# Altium project CPUboard.PrjPCB
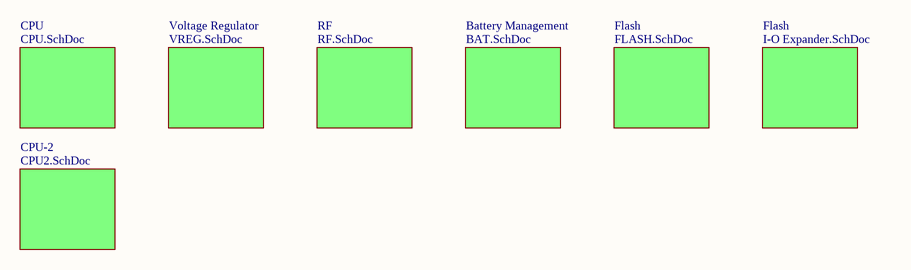
[diagram p0: CPUboard.SchDoc]
8 sheets, 86 parts. Net scope: flat (ports and power ports of the same name join across sheets).
Board file: CPUBoard.PcbDoc
Sheets:
  CPUboard.SchDoc
    RF = RF.SchDoc
    CPU = CPU.SchDoc
    Voltage Regulator = VREG.SchDoc
    Battery Management = BAT.SchDoc
    Flash = FLASH.SchDoc
    CPU-2 = CPU2.SchDoc
    Flash = I-O Expander.SchDoc

## Sheet CPUboard.SchDoc
size A

### Sub-sheets
Battery Management = BAT.SchDoc: no entries
CPU = CPU.SchDoc: no entries
CPU-2 = CPU2.SchDoc: no entries
Flash = FLASH.SchDoc: no entries
Flash = I-O Expander.SchDoc: no entries
RF = RF.SchDoc: no entries
Voltage Regulator = VREG.SchDoc: no entries

## Sheet RF.SchDoc
size A
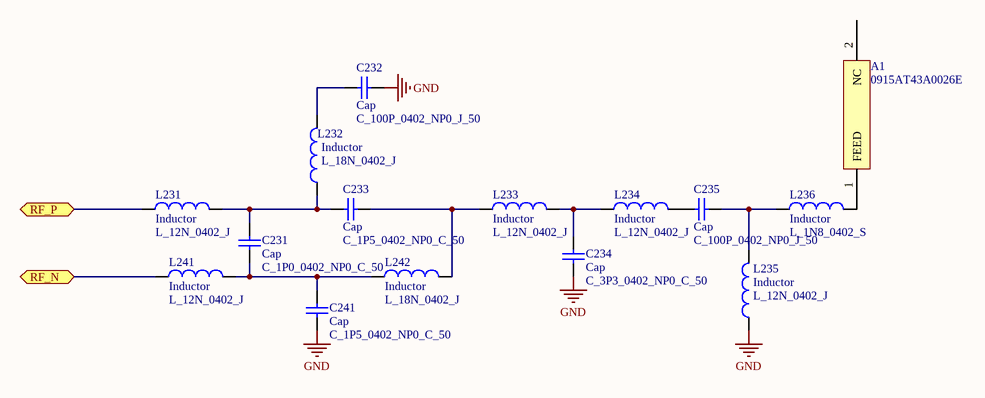
[diagram p1: RF.SchDoc]

### Parts
A1  0915AT43A0026E  [0915AT43A0026]
C231  Cap  value C_1P0_0402_NP0_C_50  [C_0402]
C232  Cap  value C_100P_0402_NP0_J_50  [C_0402]
C233  Cap  value C_1P5_0402_NP0_C_50  [C_0402]
C234  Cap  value C_3P3_0402_NP0_C_50  [C_0402]
C235  Cap  value C_100P_0402_NP0_J_50  [C_0402]
C241  Cap  value C_1P5_0402_NP0_C_50  [C_0402]
L231  Inductor  value L_12N_0402_J  [R_0402]
L232  Inductor  value L_18N_0402_J  [R_0402]
L233  Inductor  value L_12N_0402_J  [R_0402]
L234  Inductor  value L_12N_0402_J  [R_0402]
L235  Inductor  value L_12N_0402_J  [R_0402]
L236  Inductor  value L_1N8_0402_S  [R_0402]
L241  Inductor  value L_12N_0402_J
L242  Inductor  value L_18N_0402_J  [R_0402]

### Ports
RF_N, RF_P

### Nets
GND: C232.2 C234.1 C241.1 L235.1
RF_N: L241.1 ; port RF_N
RF_P: L231.1 ; port RF_P
NetA1_1: A1.1(FEED) L236.2
NetC231_1: C231.1 C241.2 L241.2 L242.1
NetC231_2: C231.2 C233.1 L231.2 L232.1
NetC232_1: C232.1 L232.2
NetC233_2: C233.2 L233.1 L242.2
NetC234_2: C234.2 L233.2 L234.1
NetC235_1: C235.1 L234.2
NetC235_2: C235.2 L235.2 L236.1

Not connected (* = marked no-connect by the designer): A1 2(NC)

### Library data of the parts
A1 = 0915AT43A0026E: RF CHIP ANTENNA 902 - 928MHZ; Manufacturer: Johanson Technology Inc; Number of Bands: 1; Frequency: 902MHz ~ 928MHz; Gain: -1dBi; Supplier 1: Digi-Key; Manufacturer Part Number: 0915AT43A0026E; RoHS: RoHS Compliant; Category: RF/IF and RFID; Stock 1: 832; Pricing 1: 1=1.22, 10=1.022, 25=0.8808, 50=0.8266, 100=0.6525, 250=0.54376, 500=0.48938 (USD); Antenna Type: Chip; VSWR: -; Termination: Surface Mount; Mounting Type: Surface Mount; Height (Max): -; Packaging: Cut Tape (CT); Supplier Part Number 1: 712-1535-1-ND
C231-C235 C241 = Cap: Capacitor; Published: 8-Jun-2000; LatestRevisionDate: 17-Jul-2002; LatestRevisionNote: Re-released for DXP Platform.; Publisher: Altium Limited; Supplier 1: Digi-Key
  C231: Supplier Part Number 1: 490-3199-1-ND; Supplier 2: Mouser; Supplier Part Number 2: 81-GRM1555C1H1R0CZ01
  C232 C235: Supplier Part Number 1: 490-3458-1-ND
  C233 C241: Supplier Part Number 1: 490-1266-1-ND; Supplier 2: Mouser; Supplier Part Number 2: 81-GRM36C1R5C50
  C234: Supplier Part Number 1: 490-1270-1-ND; Supplier 2: Mouser; Supplier Part Number 2: 81-GRM36C3R3C50
L231-L236 L241 L242 = Inductor: Code_IEC: 1005; Published: 8-Jun-2000; LatestRevisionDate: 29-May-2009; LatestRevisionNote: IPC-7351 Footprint Added.; PackageReference: 0402-A; Publisher: Altium Limited; PackageDescription: Chip Inductor; Code_JEITA: 0402; Supplier 1: Digi-Key; Supplier 2: Mouser
  L231 L233-L235 L241: Supplier Part Number 1: 490-2624-1-ND; Supplier Part Number 2: 81-LQG15HS12NJ02D
  L232 L242: Supplier Part Number 1: 490-2626-1-ND; Supplier Part Number 2: 81-LQG15HS18NJ02D
  L236: Supplier Part Number 1: 490-1127-1-ND; Supplier Part Number 2: 81-LQP15MN1N8B02D

## Sheet CPU.SchDoc
size A4
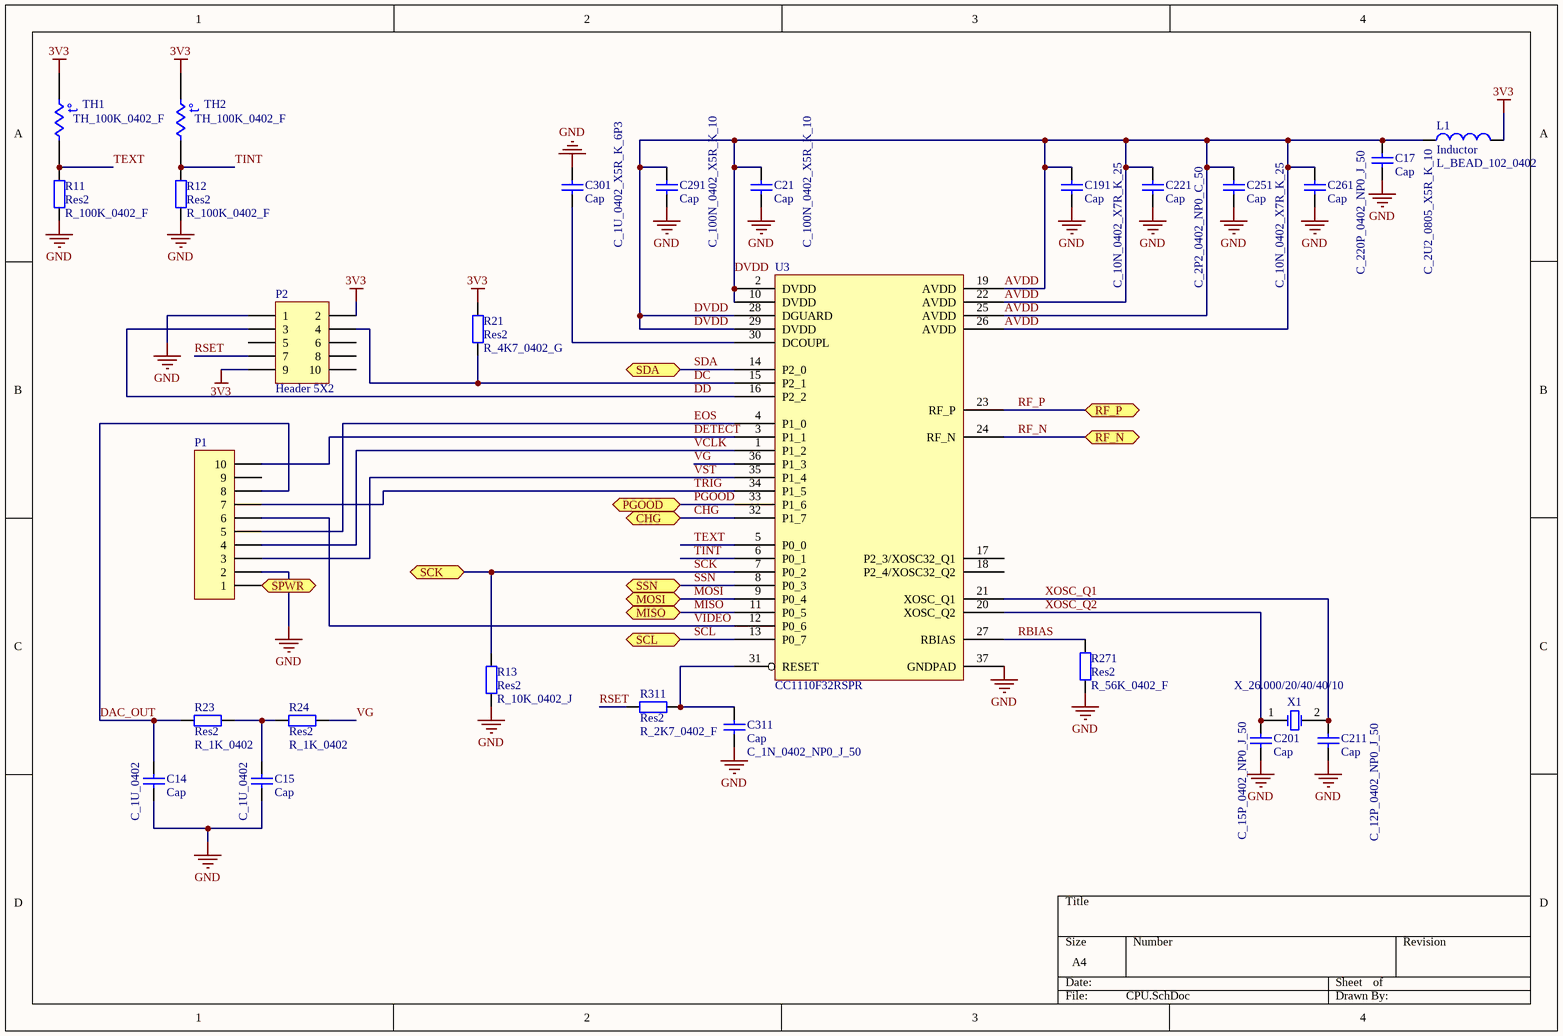
[diagram p2: CPU.SchDoc]

### Parts
C14  Cap  value C_1U_0402  [C_0402]
C15  Cap  value C_1U_0402  [C_0402]
C17  Cap  value C_2U2_0805_X5R_K_10  [C_0805]
C21  Cap  value C_100N_0402_X5R_K_10  [C_0402]
C191  Cap  value C_10N_0402_X7R_K_25  [C_0402]
C201  Cap  value C_15P_0402_NP0_J_50  [C_0402]
C211  Cap  value C_12P_0402_NP0_J_50  [C_0402]
C221  Cap  value C_2P2_0402_NP0_C_50  [C_0402]
C251  Cap  value C_10N_0402_X7R_K_25  [C_0402]
C261  Cap  value C_220P_0402_NP0_J_50  [C_0402]
C291  Cap  value C_100N_0402_X5R_K_10  [C_0402]
C301  Cap  value C_1U_0402_X5R_K_6P3  [C_0402]
C311  Cap  value C_1N_0402_NP0_J_50  [C_0402]
L1  Inductor  value L_BEAD_102_0402  [R_0402]
P1  Header 10  [609-4377-ND Female]  (value not drawn)
P2  Header 5X2  [SMD HEADER]
R11  Res2  value R_100K_0402_F  [R_0402]
R12  Res2  value R_100K_0402_F  [R_0402]
R13  Res2  value R_10K_0402_J  [R_0402]
R21  Res2  value R_4K7_0402_G  [R_0402]
R23  Res2  value R_1K_0402  [R_0402]
R24  Res2  value R_1K_0402  [R_0402]
R271  Res2  value R_56K_0402_F  [R_0402]
R311  Res2  value R_2K7_0402_F  [R_0402]
TH1  value TH_100K_0402_F  [R_0402]  (hidden comment: Res Thermal)
TH2  value TH_100K_0402_F  [R_0402]  (hidden comment: Res Thermal)
U3  CC1110F32RSPR  [TI_QFP36]
X1  X_26.000/20/40/40/10  [NX3225GA]

### Ports
CHG, MISO, MOSI, PGOOD, RF_N, RF_P, SCK, SCL, SDA, SPWR, SSN

### Nets
3V3: L1.2 P2.2 P2.9 R21.2 TH1.1 TH2.1
GND: C14.1 C15.1 C17.1 C21.1 C191.1 C201.1 C211.1 C221.1 C251.1 C261.1 C291.1 C301.2 C311.1 P1.2 P2.1 R11.1 R12.1 R13.1 R271.1 U3.37(GNDPAD)
AVDD: C17.2 C21.2 C191.2 C221.2 C251.2 C261.2 C291.2 L1.1 U3.2(DVDD) U3.10(DVDD) U3.19(AVDD) U3.22(AVDD) U3.25(AVDD) U3.26(AVDD) U3.28(DGUARD) U3.29(DVDD)  [also labelled DVDD]
CHG: U3.32(P1_7) ; port CHG
DAC_OUT: C14.2 P1.8 R23.2
DC: P2.4 R21.1 U3.15(P2_1)
DD: P2.3 U3.16(P2_2)
DETECT: P1.10 U3.3(P1_1)
EOS: P1.5 U3.4(P1_0)
MISO: U3.11(P0_5) ; port MISO
MOSI: U3.9(P0_4) ; port MOSI
PGOOD: U3.33(P1_6) ; port PGOOD
RBIAS: R271.2 U3.27(RBIAS)
RF_N: U3.24(RF_N) ; port RF_N
RF_P: U3.23(RF_P) ; port RF_P
RSET: P2.7 R311.1
SCK: R13.2 U3.7(P0_2) ; port SCK
SCL: U3.13(P0_7) ; port SCL
SDA: U3.14(P2_0) ; port SDA
SSN: U3.8(P0_3) ; port SSN
TEXT: R11.2 TH1.2 U3.5(P0_0)
TINT: R12.2 TH2.2 U3.6(P0_1)
TRIG: P1.7 U3.34(P1_5)
VCLK: P1.4 U3.1(P1_2)
VG: R24.1 U3.36(P1_3)
VIDEO: P1.6 U3.12(P0_6)
VST: P1.3 U3.35(P1_4)
XOSC_Q1: C211.2 U3.21(XOSC_Q1) X1.2(OSC2)
XOSC_Q2: C201.2 U3.20(XOSC_Q2) X1.1(OSC1)
NetC15_2: C15.2 R23.1 R24.2
NetC301_1: C301.1 U3.30(DCOUPL)
NetC311_2: C311.2 R311.2 U3.31(RESET)
NetP1_1: P1.1 ; port SPWR

Not connected (* = marked no-connect by the designer): P1 9; P2 5 6 8 10; U3 17(P2_3/XOSC32_Q1) 18(P2_4/XOSC32_Q2)

### Notes on the sheet
- (in symbol Res Thermal) t°

### Library data of the parts
C14 C15 C17 C21 C191 C201 C211 C221 C251 C261 C291 C301 C311 = Cap: Capacitor; Published: 8-Jun-2000; LatestRevisionDate: 17-Jul-2002; LatestRevisionNote: Re-released for DXP Platform.; Publisher: Altium Limited; Supplier 1: Digi-Key
  C14 C15: Supplier Part Number 1: 587-1231-1-ND
  C17: Supplier Part Number 1: 445-3459-1-ND; Supplier 2: Mouser; Supplier Part Number 2: 81-GRM219R61A225KA1D
  C21 C291: Supplier Part Number 1: 490-1318-6-ND; Supplier 2: Mouser; Supplier Part Number 2: 81-GRM155R61A104KA01
  C191 C251: Supplier Part Number 1: 490-1312-1-ND
  C201: Supplier Part Number 1: 490-1280-1-ND; Supplier 2: Mouser; Supplier Part Number 2: 81-GRM36C150J50
  C211: Supplier Part Number 1: 490-1279-1-ND; Supplier 2: Mouser; Supplier Part Number 2: 81-GRM36C120J50
  C221: Supplier Part Number 1: 490-1267-1-ND; Supplier 2: Mouser; Supplier Part Number 2: 81-GRM36C2R2C50
  C261: Supplier Part Number 1: 490-1293-1-ND; Supplier 2: Mouser; Supplier Part Number 2: 81-GRM1555C1H221JA01
  C301: Supplier Part Number 1: 490-1320-1-ND; Supplier 2: Mouser; Supplier Part Number 2: 81-GRM155R60J105KE19
  C311: Supplier Part Number 1: 490-3244-1-ND; Supplier 2: Mouser; Supplier Part Number 2: 81-GRM1555C1H102JA1D
L1 = Inductor: Code_IEC: 1005; Published: 8-Jun-2000; LatestRevisionDate: 29-May-2009; LatestRevisionNote: IPC-7351 Footprint Added.; PackageReference: 0402-A; Publisher: Altium Limited; PackageDescription: Chip Inductor; Code_JEITA: 0402; Supplier 1: Digi-Key; Supplier Part Number 1: 490-3999-1-ND; Supplier 2: Mouser; Supplier Part Number 2: 81-BLM15HG102SN1D
P1 = Header 10: Header, 10-Pin; LatestRevisionDate: 17-Jul-2002; LatestRevisionNote: Re-released for DXP Platform.; Publisher: Altium Limited
P2 = Header 5X2: Header, 5-Pin, Dual row; LatestRevisionDate: 17-Jul-2002; LatestRevisionNote: Re-released for DXP Platform.; Publisher: Altium Limited; Supplier 1: Digi-Key; Supplier Part Number 1: FTSH-105-01-L-DV-TR-ND
R11-R13 R21 R23 R24 R271 R311 = Res2: Resistor; Published: 8-Jun-2000; LatestRevisionDate: 17-Jul-2002; LatestRevisionNote: Re-released for DXP Platform.; Publisher: Altium Limited; Supplier 1: Digi-Key
  R11 R12: Supplier Part Number 1: 541-100KLCT-ND; Supplier 2: Mouser; Supplier Part Number 2: 71-CRCW0402-100K-E3
  R13: Supplier Part Number 1: P10KJCT-ND; Supplier 2: Mouser; Supplier Part Number 2: 667-ERJ-2GEJ103X
  R21: PackageReference: AXIAL-0.4; PackageDescription: Axial Device, Thru-Hole; 2 Leads; 0.4 in Pin Spacing; Supplier Part Number 1: 311-4.7KJRCT-ND
  R23 R24: Supplier Part Number 1: RMCF0402JT1K00CT-ND
  R271: Supplier Part Number 1: 541-56.0KLCT-ND; Supplier 2: Mouser; Supplier Part Number 2: 71-CRCW040256K0FKED
  R311: Supplier Part Number 1: 541-2.70KLCT-ND; Supplier 2: Mouser; Supplier Part Number 2: 71-CRCW0402-2.7K-E3
TH1 TH2 = Res Thermal: Thermistor; Published: 24-Mar-1999; LatestRevisionDate: 29-May-2009; LatestRevisionNote: IPC-7351 Footprint Added.; PackageVersion: Mar-2003; PackageReference: 6-0805; Publisher: Altium Limited; PackageDescription: Chip Resistor 0805 Case Size; Code_IPC: RESC2012; Supplier 1: Digi-Key; Supplier Part Number 1: 490-4803-1-ND; Supplier 2: Mouser; Supplier Part Number 2: 81-NCP15WF104F03RC
U3 = CC1110F32RSPR: RF Microcontrollers (MCU) True System-on-Chip; Manufacturer: Texas Instruments; Interface Type: 3-Wire SPI; Supply Voltage (Max): 3.6 V; Supply Voltage (Min): 2 V; Operating Supply Voltage: 2 V to 3.6 V; Manufacturer Part Number: CC1110F32RSPR; RoHS: RoHS Compliant; Category: RF Microcontrollers (MCU); Stock 1: 10995; Pricing 1: 1=5.75, 25=4.60, 100=3.68, 250=3.06, 500=2.99, 1000=2.95, 2000=2.90, 2500=2.90 (USD); Operating Temperature Range: - 40 C to + 85 C; Package / Case: QFN-36; Packaging: Reel; Mounting Style: SMD/SMT; Maximum Operating Temperature: + 85 C; Minimum Operating Temperature: - 40 C; Product Category: RF Integrated Circuits; Standard Pack Qty: 2500; RoHS - Mouser: Y; Minimum Order Quantity: 1; Reeling: True; ComponentLink1URL: http://www.ti.com/lit/ds/symlink/cc1110f32.pdf; ComponentLink1Description: http://www.ti.com/lit/ds/symlink/cc1110f32.pdf; Supplier 1: Digi-Key; Supplier Part Number 1: CC1110F32RSPG3-ND; Supplier 2: Mouser; Supplier Part Number 2: 595-CC1110F32RSPR; Supplier 3: Digi-Key; Supplier Part Number 3: 296-22740-1-ND; Supplier 4: Digi-Key; Supplier Part Number 4: 296-22740-2-ND; Supplier 5: Digi-Key; Supplier Part Number 5: 296-22740-6-ND
X1 = XTAL: Crystal Oscillator; Published: 8-Jun-2000; LatestRevisionDate: 17-Jul-2002; LatestRevisionNote: Re-released for DXP Platform.; PackageReference: R38; Publisher: Altium Limited; PackageDescription: Crystal, Thru-Hole; 2 Leads; Body 3.1 x 8.2 mm (Dia.xH); Supplier 1: Digi-Key; Supplier Part Number 1: 644-1160-2-ND

## Sheet VREG.SchDoc
size A
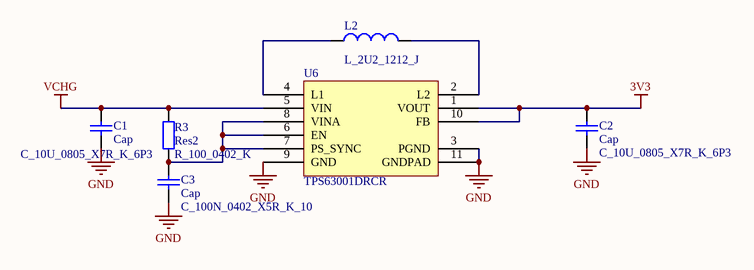
[diagram p3: VREG.SchDoc]

### Parts
C1  Cap  value C_10U_0805_X7R_K_6P3  [C_0805]
C2  Cap  value C_10U_0805_X7R_K_6P3  [C_0805]
C3  Cap  value C_100N_0402_X5R_K_10  [C_0402]
L2  value L_2U2_1212_J  [L_1212]  (hidden comment: Inductor)
R3  Res2  value R_100_0402_K  [R_0402]
U6  TPS63001DRCR  [S-PVSON-N10]

### Nets
3V3: C2.2 U6.1(VOUT) U6.10(FB)
GND: C1.1 C2.1 C3.1 U6.3(PGND) U6.9(GND) U6.11(GNDPAD)
VCHG: C1.2 R3.2 U6.5(VIN)
NetC3_2: C3.2 R3.1 U6.6(EN) U6.7(PS_SYNC) U6.8(VINA)
NetL2_1: L2.1 U6.4(L1)
NetL2_2: L2.2 U6.2(L2)

### Library data of the parts
C1-C3 = Cap: Capacitor; Published: 8-Jun-2000; LatestRevisionDate: 17-Jul-2002; LatestRevisionNote: Re-released for DXP Platform.; Publisher: Altium Limited; Supplier 1: Digi-Key; Supplier 2: Mouser
  C1 C2: Supplier Part Number 1: 490-3904-1-ND; Supplier Part Number 2: 81-GRM21BR70J106KE76
  C3: Supplier Part Number 1: 490-1318-6-ND; Supplier Part Number 2: 81-GRM155R61A104KA01
R3 = Res2: Resistor; Published: 8-Jun-2000; LatestRevisionDate: 17-Jul-2002; LatestRevisionNote: Re-released for DXP Platform.; PackageReference: AXIAL-0.4; Publisher: Altium Limited; PackageDescription: Axial Device, Thru-Hole; 2 Leads; 0.4 in Pin Spacing; Supplier 1: Digi-Key; Supplier Part Number 1: P100JTR-ND; Supplier 2: Mouser; Supplier Part Number 2: 667-ERJ-3GEYJ101V
U6 = TPS63001DRCR: DC/DC Switching Regulators 96% Buck-Boost Conv; Manufacturer: Texas Instruments; Number of Outputs: 1; Output Current: 1.8 A; Output Voltage: 5.5 V; Manufacturer Part Number: TPS63001DRCR; RoHS: RoHS Compliant; Category: DC/DC Switching Regulators; Stock 1: 12364; Pricing 1: 1=3.65, 25=3.33, 100=3.07, 250=2.13, 500=2.02, 1000=1.91 (USD); Package / Case: SON-10; Packaging: Reel; Mounting Style: SMD/SMT; Product Category: Regulators - Non-Isolated Switching DC/DC; Standard Pack Qty: 3000; RoHS - Mouser: Y; Minimum Order Quantity: 1; Reeling: True; ComponentLink1URL: http://focus.ti.com/lit/ds/symlink/tps63000.pdf; ComponentLink1Description: http://focus.ti.com/lit/ds/symlink/tps63000.pdf; Supplier 1: Digi-Key; Supplier Part Number 1: 296-32517-2-ND; Supplier 2: Mouser; Supplier Part Number 2: 595-TPS63001DRCR
L2 = Inductor: Published: 8-Jun-2000; LatestRevisionDate: 29-May-2009; LatestRevisionNote: IPC-7351 Footprint Added.; Publisher: Altium Limited; PackageDescription: Chip Inductor; Supplier 1: Digi-Key; Supplier Part Number 1: 490-5119-1-ND; Supplier 2: Mouser; Supplier Part Number 2: 81-LQH3NPN2R2NG0L

## Sheet BAT.SchDoc
size A
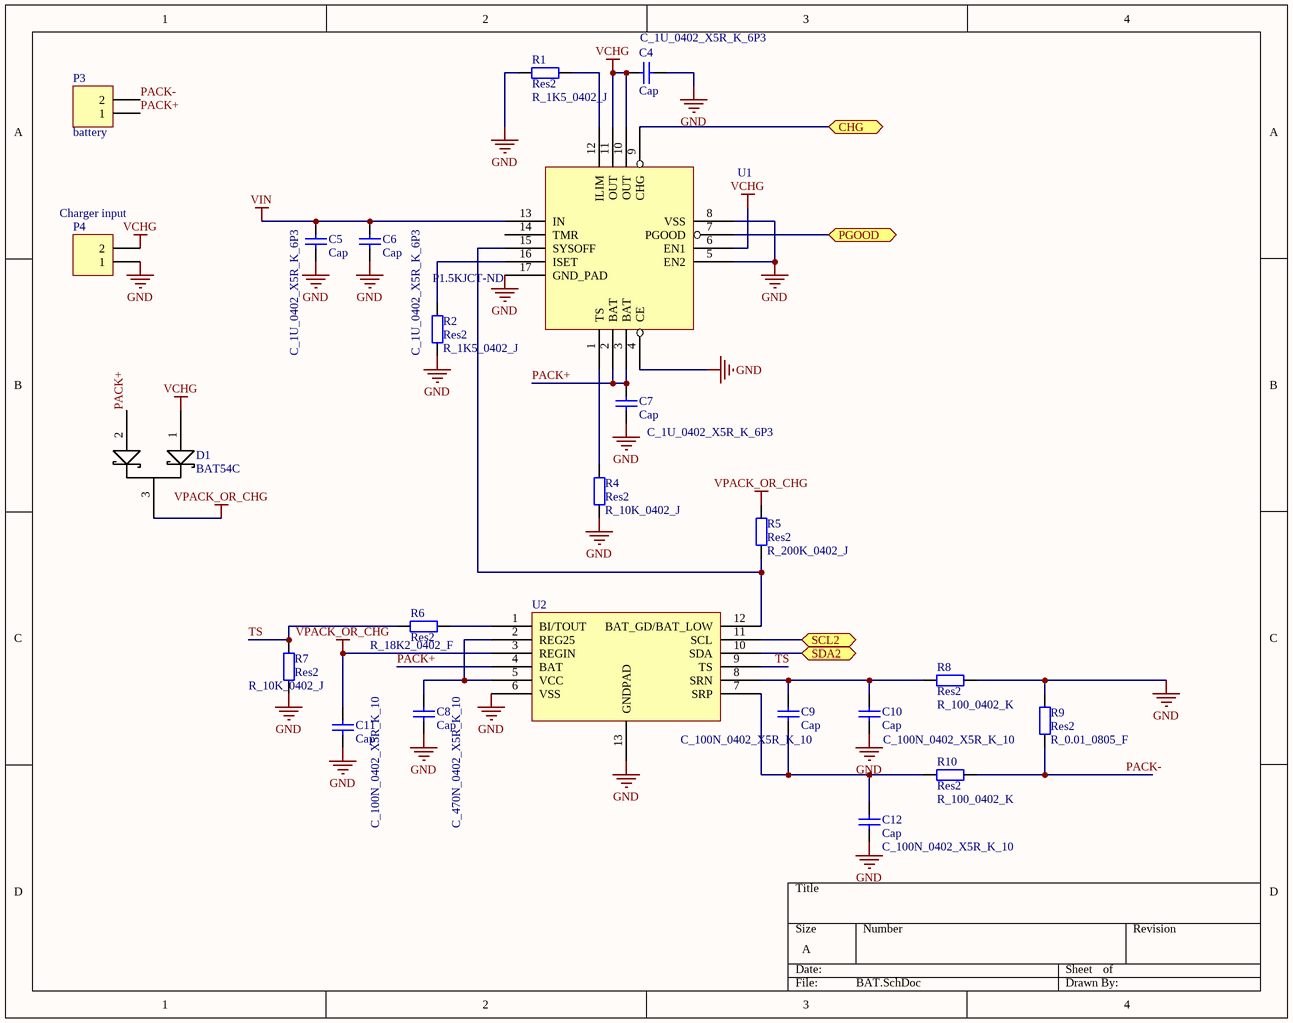
[diagram p4: BAT.SchDoc]

### Parts
C4  Cap  value C_1U_0402_X5R_K_6P3  [C_0402]
C5  Cap  value C_1U_0402_X5R_K_6P3  [C_0402]
C6  Cap  value C_1U_0402_X5R_K_6P3  [C_0402]
C7  Cap  value C_1U_0402_X5R_K_6P3  [C_0402]
C8  Cap  value C_470N_0402_X5R_K_10  [C_0402]
C9  Cap  value C_100N_0402_X5R_K_10  [C_0402]
C10  Cap  value C_100N_0402_X5R_K_10  [C_0402]
C11  Cap  value C_100N_0402_X5R_K_10  [C_0402]
C12  Cap  value C_100N_0402_X5R_K_10  [C_0402]
D1  BAT54C  [SOT-23_N]
P3  battery  [PL-041939]
P4  Charger input  [HDR1X2]
R1  Res2  value R_1K5_0402_J  [R_0402]
R2  Res2  value R_1K5_0402_J  Supplier Part Number 1: P1.5KJCT-ND  [R_0402]
R4  Res2  value R_10K_0402_J  [R_0402]
R5  Res2  value R_200K_0402_J  [R_0402]
R6  Res2  value R_18K2_0402_F  [R_0402]
R7  Res2  value R_10K_0402_J  [R_0402]
R8  Res2  value R_100_0402_K  [R_0402]
R9  Res2  value R_0.01_0805_F  [R_0805]
R10  Res2  value R_100_0402_K  [R_0402]
U1  BQ24079TRGTR  [S-PVQFN-N16]  (value not drawn)
U2  BQ27510DRZR-G2  [S-PDSO-N12]  (value not drawn)

### Ports
CHG, PGOOD, SCL2, SDA2

### Nets
GND: C4.1 C5.1 C6.1 C7.1 C8.1 C10.1 C11.1 C12.1 P4.1 R1.1 R2.2 R4.1 R7.1 R8.2 R9.2 U1.4(CE) U1.5(EN2) U1.8(VSS) U1.17(GND_PAD) U2.6(VSS) U2.13(GNDPAD)
VCHG: C4.2 D1.1 P4.2 U1.6(EN1) U1.10(OUT) U1.11(OUT)
VIN: C5.2 C6.2 U1.13(IN)
VPACK_OR_CHG: C11.2 D1.3 R5.1 U2.3(REGIN)
CHG: U1.9(CHG) ; port CHG
PACK+: C7.2 D1.2 P3.1 U1.2(BAT) U1.3(BAT) U2.4(BAT)
PACK-: P3.2 R9.1 R10.2
PGOOD: U1.7(PGOOD) ; port PGOOD
SCL2: U2.11(SCL) ; port SCL2
SDA2: U2.10(SDA) ; port SDA2
TS: R6.1 R7.2 U2.9(TS)
NetC8_2: C8.2 U2.2(REG25) U2.5(VCC)
NetC9_1: C9.1 C12.2 R10.1 U2.7(SRP)
NetC9_2: C9.2 C10.2 R8.1 U2.8(SRN)
NetR1_2: R1.2 U1.12(ILIM)
NetR2_1: R2.1 U1.16(ISET)
NetR4_2: R4.2 U1.1(TS)
NetR5_2: R5.2 U1.15(SYSOFF) U2.12(BAT_GD/BAT_LOW)
NetR6_2: R6.2 U2.1(BI/TOUT)

Not connected (* = marked no-connect by the designer): U1 14(TMR)

### Library data of the parts
C4-C12 = Cap: Capacitor; Published: 8-Jun-2000; LatestRevisionDate: 17-Jul-2002; LatestRevisionNote: Re-released for DXP Platform.; Publisher: Altium Limited; Supplier 1: Digi-Key; Supplier 2: Mouser
  C4-C7: Supplier Part Number 1: 490-1320-1-ND; Supplier Part Number 2: 81-GRM155R60J105KE19
  C8: Supplier Part Number 1: 490-3264-1-ND; Supplier Part Number 2: 81-GRM155R61A474KE5D
  C9-C12: Supplier Part Number 1: 490-1318-6-ND; Supplier Part Number 2: 81-GRM155R61A104KA01
D1 = BAT54C: FAIRCHILD SEMICONDUCTOR - BAT54C - SCHOTTKY RECTIFIER, CMN CTHD 0.2A SOT-23; Diode Configuration: Common Cathode; Repetitive Reverse Voltage Vrrm Max: 30; Forward Current If(AV): 200; Forward Voltage VF Max: 800; Reverse Recovery Time trr Max: 5; Manufacturer: FAIRCHILD SEMICONDUCTOR; Manufacturer Part Number: BAT54C; RoHS: YES; Stock 1: 19500; Pricing 1: 1=0.037, 25=0.033, 100=0.033, 250=0.028, 500=0.025, 1000=0.024 (USD); Diode Type: Schottky; ComponentLink1URL: http://www.fairchildsemi.com/ds/BA/BAT54C.pdf; ComponentLink1Description: http://www.fairchildsemi.com/ds/BA/BAT54C.pdf; Supplier 1: Digi-Key; Supplier Part Number 1: BAT54C-V-GS08GIDKR-ND; Supplier 2: Mouser; Supplier Part Number 2: 512-BAT54C
P3 = Header 2: Header, 2-Pin; LatestRevisionDate: 17-Jul-2002; LatestRevisionNote: Re-released for DXP Platform.; Publisher: Altium Limited
P4 = Header 2: SM Battery Holder 1/2 AA; LatestRevisionDate: 17-Jul-2002; LatestRevisionNote: Re-released for DXP Platform.; Publisher: Altium Limited; Supplier 1: Digi-Key; Supplier Part Number 1: 1016K-ND; Supplier 2: Newark; Supplier Part Number 2: 57R3956
R1 R2 R4-R8 R10 = Res2: Resistor; Published: 8-Jun-2000; LatestRevisionDate: 17-Jul-2002; LatestRevisionNote: Re-released for DXP Platform.; PackageReference: AXIAL-0.4; Publisher: Altium Limited; PackageDescription: Axial Device, Thru-Hole; 2 Leads; 0.4 in Pin Spacing; Supplier 1: Digi-Key
  R1: Supplier Part Number 1: P1.5KJCT-ND
  R4 R7: Supplier Part Number 1: P10KJCT-ND; Supplier 2: Mouser; Supplier Part Number 2: 667-ERJ-2GEJ103X
  R5: Supplier Part Number 1: P200KJCT-ND
  R6: Supplier Part Number 1: P18.2KLCT-ND; Supplier 2: Mouser; Supplier Part Number 2: 667-ERJ-2RKF1822X
  R8 R10: Supplier Part Number 1: P100GCT-ND; Supplier 2: Mouser; Supplier Part Number 2: 667-ERJ-3GEYJ101V
R9 = Res2: Resistor; Manufacturer: Panasonic Electronic Components; Manufacturer Part Number: ERJ-6BWFR010V; Description: Thick Film Resistors - SMD 0805 0.010ohms 1% Tol; Power Rating: 250 mWatts (1/4 Watt); Resistance: 10 mOhms; Temperature Coefficient: 300 PPM / C; Tolerance: 5 %; Product Status: New at Mouser; Published: 8-Jun-2000; LatestRevisionDate: 17-Jul-2002; LatestRevisionNote: Re-released for DXP Platform.; Publisher: Altium Limited; Supplier 1: Digi-Key; Supplier Part Number 1: P.01AQCT-ND; Supplier 2: Mouser; Supplier Part Number 2: 667-ERJ-6BWFR010V; RoHS: RoHS Compliant By Exemption; Category: Thick Film Resistors - SMD; Stock 2: 2239; Pricing 2: 1=1.04, 25=0.772, 100=0.709, 250=0.626, 500=0.521, 1000=0.406, 2000=0.337, 5000=0.269, 10000=0.261 (USD); Dimensions: 1.2 mm W x 2 mm L x 0.6 mm H; Operating Temperature Range: - 55 C to + 155 C; Package / Case: 0805 (2012 metric); Packaging: Reel; Product: Thick Film Resistors SMD; Series: ERJ; Termination Style: SMD/SMT; Product Category: .; RoHS - Mouser: E; Minimum Order Quantity: 1; Reeling: True; ComponentLink1URL: http://industrial.panasonic.com/www-data/pdf/AOA0000/AOA0000CE3.pdf; ComponentLink1Description: http://industrial.panasonic.com/www-data/pdf/AOA0000/AOA0000CE3.pdf
U1 = BQ24079TRGTR: IC LI-ION CHARGE/PWR MGMT 16QFN; Manufacturer: Texas Instruments; Function: Charge Management; Battery Chemistry: Lithium-Ion (Li-Ion); Voltage - Supply: 4.35 V ~ 26 V; Supplier 1: Digi-Key; Manufacturer Part Number: BQ24079TRGTR; RoHS: RoHS Compliant; Category: Integrated Circuits (ICs); Stock 1: 2351; Pricing 1: 1=2.88, 10=2.58, 25=2.32, 100=2.11, 250=1.91, 500=1.71, 1000=1.44 (USD); Operating Temperature: -40°C ~ 85°C; Mounting Type: Surface Mount; Package / Case: 16-VFQFN Exposed Pad; Supplier Device Package: 16-QFN-EP (3x3); Packaging: Cut Tape (CT); ComponentLink1URL: http://www.ti.com/lit/ds/symlink/bq24075t.pdf; ComponentLink1Description: http://www.ti.com/lit/ds/symlink/bq24075t.pdf; Supplier Part Number 1: 296-25610-1-ND
U2 = BQ27510DRZR-G2: IC BATT FUEL GAUGE LI-ION 12SON; Manufacturer: Texas Instruments; Function: Fuel, Gas Gauge/Monitor; Battery Chemistry: Lithium-Ion (Li-Ion); Voltage - Supply: 2.7 V ~ 5.5 V; Supplier 1: Digi-Key; Manufacturer Part Number: BQ27510DRZR-G2; RoHS: RoHS Compliant; Category: Integrated Circuits (ICs); Stock 1: 1001; Pricing 1: 1=4.18, 10=3.741, 25=3.364, 100=3.0595, 250=2.76952, 500=2.4795, 1000=2.088 (USD); Operating Temperature: -40°C ~ 85°C; Mounting Type: Surface Mount; Package / Case: 12-VFDFN Exposed Pad; Supplier Device Package: 12-SON Exposed Pad (2.5x4); Packaging: Cut Tape (CT); ComponentLink1URL: http://www.ti.com/lit/ds/symlink/bq27510-g2.pdf; ComponentLink1Description: http://www.ti.com/lit/ds/symlink/bq27510-g2.pdf; Supplier 2: Mouser; Supplier Part Number 1: 296-27728-1-ND; Supplier Part Number 2: 595-BQ27510DRZT-G2

## Sheet FLASH.SchDoc
size A
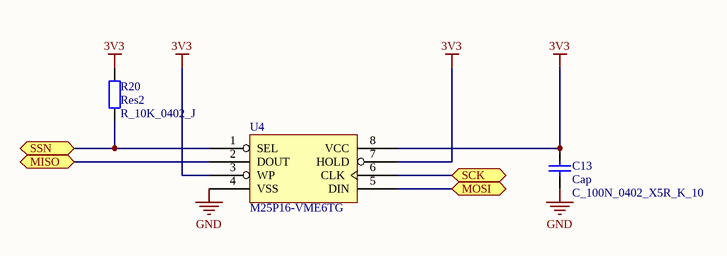
[diagram p5: FLASH.SchDoc]

### Parts
C13  Cap  value C_100N_0402_X5R_K_10  [C_0402]
R20  Res2  value R_10K_0402_J  [R_0402]
U4  M25P16-VME6TG  [VQFNPN8]

### Ports
MISO, MOSI, SCK, SSN

### Nets
3V3: C13.2 R20.2 U4.3(WP) U4.7(HOLD) U4.8(VCC)
GND: C13.1 U4.4(VSS)
MISO: U4.2(DOUT) ; port MISO
MOSI: U4.5(DIN) ; port MOSI
SCK: U4.6(CLK) ; port SCK
SSN: R20.1 U4.1(SEL) ; port SSN

### Library data of the parts
C13 = Cap: Capacitor; Published: 8-Jun-2000; LatestRevisionDate: 17-Jul-2002; LatestRevisionNote: Re-released for DXP Platform.; Publisher: Altium Limited; Supplier 1: Digi-Key; Supplier Part Number 1: 490-1318-6-ND; Supplier 2: Mouser; Supplier Part Number 2: 81-GRM155R61A104KA01
R20 = Res2: Resistor; Published: 8-Jun-2000; LatestRevisionDate: 17-Jul-2002; LatestRevisionNote: Re-released for DXP Platform.; PackageReference: AXIAL-0.4; Publisher: Altium Limited; PackageDescription: Axial Device, Thru-Hole; 2 Leads; 0.4 in Pin Spacing; Supplier 1: Digi-Key; Supplier Part Number 1: 311-10KJRCT-ND
U4 = M25P16-VME6TG: IC FLASH 16MBIT 75MHZ 8VDFPN; Manufacturer: Micron Technology Inc; Memory Type: FLASH - Nor; Memory Size: 16M (2M x 8); Interface: SPI Serial; Voltage - Supply: 2.7 V ~ 3.6 V; Supplier 1: Digi-Key; Manufacturer Part Number: M25P16-VME6TG; RoHS: RoHS Compliant; Category: Integrated Circuits (ICs); Stock 1: 3584; Pricing 1: 1=1.17, 10=1.062, 25=1.0488, 50=1.0428, 100=0.9322, 250=0.92436, 500=0.91066, 1000=0.87785 (USD); Format - Memory: FLASH; Speed: 75MHz; Operating Temperature: -40°C ~ 85°C; Package / Case: 8-VDFN Exposed Pad; Supplier Device Package: 8-VDFPN (MLP8) (8x6); Packaging: Cut Tape (CT); ComponentLink1URL: http://media.digikey.com/pdf/Data%20Sheets/Numonyx,Intel/M25P16.pdf; ComponentLink1Description: http://media.digikey.com/pdf/Data%20Sheets/Numonyx,Intel/M25P16.pdf; Supplier Part Number 1: M25P16-VME6TGCT-ND

## Sheet CPU2.SchDoc
size A
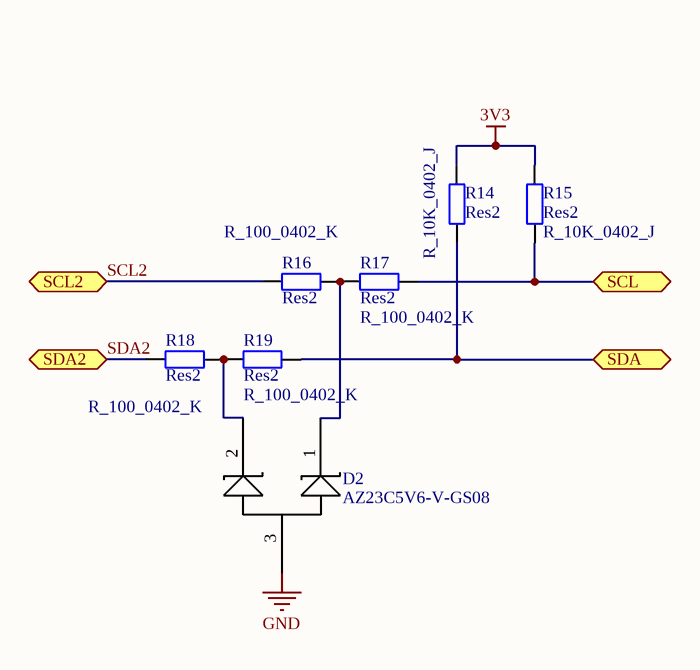
[diagram p6: CPU2.SchDoc]

### Parts
D2  AZ23C5V6-V-GS08  [SOT-23_N]
R14  Res2  value R_10K_0402_J  [R_0402]
R15  Res2  value R_10K_0402_J  [R_0402]
R16  Res2  value R_100_0402_K  [R_0402]
R17  Res2  value R_100_0402_K  [R_0402]
R18  Res2  value R_100_0402_K  [R_0402]
R19  Res2  value R_100_0402_K  [R_0402]

### Ports
SCL, SCL2, SDA, SDA2

### Nets
3V3: R14.2 R15.2
GND: D2.3
SCL: R15.1 R17.2 ; port SCL
SCL2: R16.1 ; port SCL2
SDA: R14.1 R19.2 ; port SDA
SDA2: R18.1 ; port SDA2
NetD2_1: D2.1 R16.2 R17.1
NetD2_2: D2.2 R18.2 R19.1

### Library data of the parts
D2 = AZ23C5V6-V-GS08: Zener Diodes 5.6 Volt 0.3W 5% CA; Manufacturer: Vishay Semiconductors; Power Dissipation: 300 mW; Zener Current: 5 mA; Maximum Zener Impedance: 40 Ohms; Voltage Temperature Coefficient: 0.02 % / C; Zener Voltage: 5.2 V to 6 V; Manufacturer Part Number: AZ23C5V6-V-GS08; RoHS: RoHS Compliant By Exemption; Category: Zener Diodes; Stock 1: 26255; Pricing 1: 1=0.070, 10=0.050, 50=0.049, 100=0.048, 500=0.041, 1000=0.038, 3000=0.037, 9000=0.036, 18000=0.035 (USD); Package / Case: SOT-23; Packaging: Reel; Mounting Style: SMD/SMT; Maximum Operating Temperature: + 150 C; Minimum Operating Temperature: - 65 C; Product Category: Zener Diodes; Standard Pack Qty: 15000; Voltage Tolerance: 5 %; RoHS - Mouser: E; Minimum Order Quantity: 1; Reeling: True; ComponentLink1URL: http://www.vishay.com/doc?85759; ComponentLink1Description: http://www.vishay.com/doc?85759; Supplier 1: DigiKey; Supplier Part Number 1: 78-AZ23C5V6-V; Supplier 2: Mouser; Supplier Part Number 2: 78-AZ23C5V6-V
R14-R19 = Res2: Resistor; Published: 8-Jun-2000; LatestRevisionDate: 17-Jul-2002; LatestRevisionNote: Re-released for DXP Platform.; Publisher: Altium Limited; Supplier 1: Digi-Key
  R14 R15: Supplier Part Number 1: P10KJCT-ND; Supplier 2: Mouser; Supplier Part Number 2: 667-ERJ-2GEJ103X
  R16-R19: Supplier Part Number 1: P100JTR-ND

## Sheet I-O Expander.SchDoc
size A
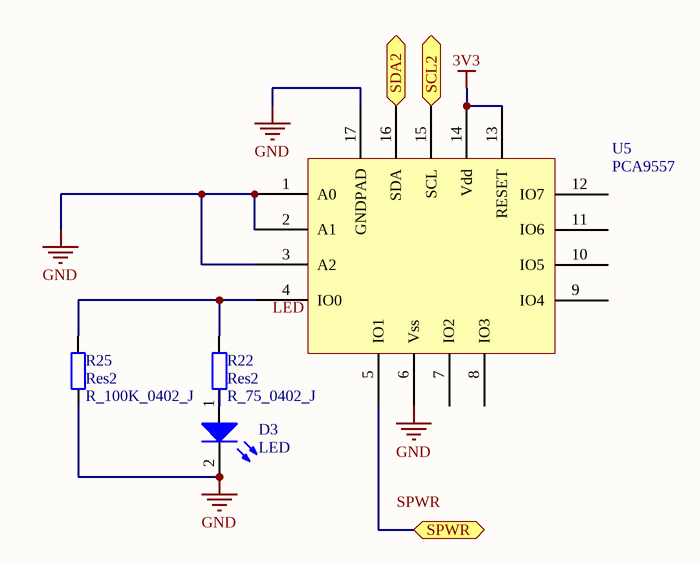
[diagram p7: I-O Expander.SchDoc]

### Parts
D3  LED  [LED]
R22  Res2  value R_75_0402_J  [R_0402]
R25  Res2  value R_100K_0402_J  [R_0402]
U5  PCA9557  [PCA9557BS]

### Ports
SCL2, SDA2, SPWR

### Nets
3V3: U5.13(RESET) U5.14(Vdd)
GND: D3.2(K) R25.1 U5.1(A0) U5.2(A1) U5.3(A2) U5.6(Vss) U5.17(GNDPAD)
SCL2: U5.15(SCL) ; port SCL2
SDA2: U5.16(SDA) ; port SDA2
NetD3_1: D3.1(A) R22.1
NetP1_1: U5.5(IO1) ; port SPWR
NetR22_2: R22.2 R25.2 U5.4(IO0)

Not connected (* = marked no-connect by the designer): U5 7(IO2) 8(IO3) 9(IO4) 10(IO5) 11(IO6) 12(IO7)

### Notes on the sheet
- Labels drawn without touching a wire or pin: LED, SPWR

### Library data of the parts
D3 = LED1: Typical RED GaAs LED; Published: 8-Jun-2000; LatestRevisionDate: 08-Jul-2005; LatestRevisionNote: Mech Layer 1 removed.; PackageReference: LED-1; Publisher: Altium Limited; PackageDescription: LED; 2 Leads; Supplier 1: Digi-Key; Supplier Part Number 1: 365-1204-ND; Supplier 2: Mouser; Supplier Part Number 2: 828-OVLLY8C7
R22 R25 = Res2: Resistor; Supplier 1: Digi-Key
  R22: Published: 8-Jun-2000; LatestRevisionDate: 17-Jul-2002; LatestRevisionNote: Re-released for DXP Platform.; PackageReference: AXIAL-0.4; Publisher: Altium Limited; PackageDescription: Axial Device, Thru-Hole; 2 Leads; 0.4 in Pin Spacing; Supplier Part Number 1: P75JTR-ND; Supplier 2: Mouser; Supplier Part Number 2: 667-ERJ-2GEJ750X
  R25: Supplier Part Number 1: 311-100KJRCT-ND
U5 = PCA9557: 8 channel IO expander

## Nets that join several sheets
3V3: CPU (6 pins), VREG (C2.2 U6.1 U6.10), FLASH (5 pins), CPU2 (R14.2 R15.2), I-O Expander (U5.13 U5.14)
GND: RF (C232.2 C234.1 C241.1 L235.1), CPU (20 pins), VREG (6 pins), BAT (21 pins), FLASH (C13.1 U4.4), CPU2 (D2.3), I-O Expander (7 pins)
VCHG: VREG (C1.2 R3.2 U6.5), BAT (6 pins)
CHG: CPU (U3.32), BAT (U1.9)
MISO: CPU (U3.11), FLASH (U4.2)
MOSI: CPU (U3.9), FLASH (U4.5)
NetP1_1: CPU (P1.1), I-O Expander (U5.5)
PGOOD: CPU (U3.33), BAT (U1.7)
RF_N: RF (L241.1), CPU (U3.24)
RF_P: RF (L231.1), CPU (U3.23)
SCK: CPU (R13.2 U3.7), FLASH (U4.6)
SCL: CPU (U3.13), CPU2 (R15.1 R17.2)
SCL2: BAT (U2.11), CPU2 (R16.1), I-O Expander (U5.15)
SDA: CPU (U3.14), CPU2 (R14.1 R19.2)
SDA2: BAT (U2.10), CPU2 (R18.1), I-O Expander (U5.16)
SSN: CPU (U3.8), FLASH (R20.1 U4.1)